# Altium schematic sheet Motor Driver.SchDoc (part 2 of 3)
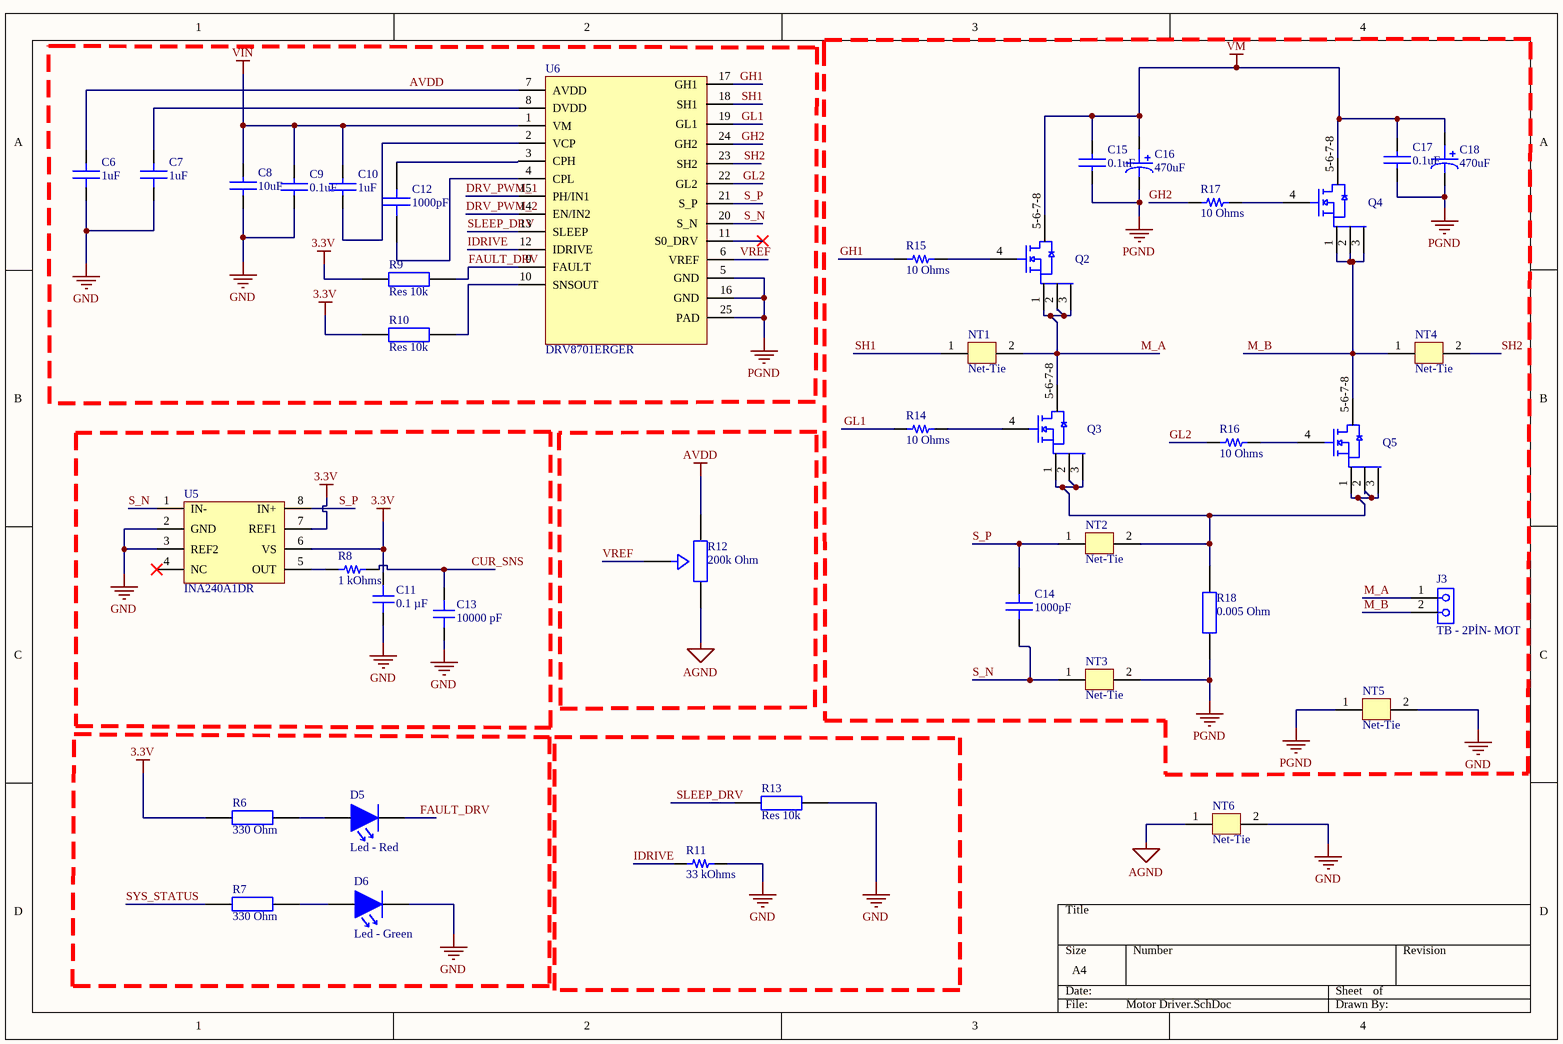
[diagram p1: Motor Driver.SchDoc]
## Library data of the parts
C6 C7 = GRM188R60J105KA01D: 0603 1 uF 6.3 V ±10% Tolerance X5R SMT Multilayer Ceramic Capacitor; Manufacturer: Murata; Manufacturer Lifecycle Status: NRND; Value: 1µF; Insulation Resistance: 500MΩ; Voltage: 6.3V; Supplier: Future Electronics; Supplier Part Number: 7369507; Manufacturer Part Number: GRM188R60J105KA01D; RoHS: Compliant; Category: Ceramic Capacitors; Stock: 12000; Pricing: 4000=0,0061, 16000=0,0059, 40000=0,0057, 100000=0,0056, 160000=0,0054 (USD); Case/Package: 0603; Case Code (Imperial): 0603; Case Code (Metric): 1608; Depth: 800µm; Dielectric: X5R; Dielectric Material: Ceramic; Height: 800µm; Lead Free: Lead Free; Length: 1.6mm; Lifecycle Status: NRND; Material: Ceramic; Max Operating Temperature: 85°C; Min Operating Temperature: -55°C; Mounting Technology: Surface Mount; Pins: 2; Number of Terminals: 2; Radiation Hardening: No; REACH SVHC: Yes; Schedule B: 8532240020, 8532240020|8532240020, 8532240020|8532240020|8532240020, 8532240020|8532240020|8532240020|8532240020; Termination: SMD/SMT; Thickness: 800µm; Tolerance: 10%; Voltage Rating: 6.3V; Voltage Rating (DC): 6.3V; Width: 800µm; ComponentLink1URL: https://datasheet.octopart.com:443/GRM188R60J105KA01D-Murata-datasheet-7599024.pdf?src-supplier=Newark; ComponentLink1Description: https://datasheet.octopart.com:443/GRM188R60J105KA01D-Murata-datasheet-7599024.pdf?src-supplier=Newark; ComponentLink2URL: https://datasheet.octopart.com:443/GRM188R60J105KA01D-Murata-datasheet-101584256.pdf?src-supplier=element14+APAC; ComponentLink2Description: https://datasheet.octopart.com:443/GRM188R60J105KA01D-Murata-datasheet-101584256.pdf?src-supplier=element14+APAC; ComponentLink3URL: https://datasheet.octopart.com:443/GRM188R60J105KA01D-Murata-datasheet-49135294.pdf?src-supplier=element14+APAC; ComponentLink3Description: https://datasheet.octopart.com:443/GRM188R60J105KA01D-Murata-datasheet-49135294.pdf?src-supplier=element14+APAC; ComponentLink4URL: https://datasheet.octopart.com:443/GRM188R60J105KA01D-Murata-datasheet-165579666.pdf?src-supplier=TME; ComponentLink4Description: https://datasheet.octopart.com:443/GRM188R60J105KA01D-Murata-datasheet-165579666.pdf?src-supplier=TME; ComponentLink5URL: https://datasheet.octopart.com:443/GRM188R60J105KA01D-Murata-datasheet-59876780.pdf?src-supplier=TME; ComponentLink5Description: https://datasheet.octopart.com:443/GRM188R60J105KA01D-Murata-datasheet-59876780.pdf?src-supplier=TME; ComponentLink6URL: https://datasheet.octopart.com:443/GRM188R60J105KA01D-Murata-datasheet-140704005.pdf?src-supplier=Ciiva; ComponentLink6Description: https://datasheet.octopart.com:443/GRM188R60J105KA01D-Murata-datasheet-140704005.pdf?src-supplier=Ciiva; ComponentLink7URL: https://datasheet.octopart.com:443/GRM188R60J105KA01D-Murata-datasheet-138742778.pdf?src-supplier=Ciiva; ComponentLink7Description: https://datasheet.octopart.com:443/GRM188R60J105KA01D-Murata-datasheet-138742778.pdf?src-supplier=Ciiva; ComponentLink8URL: https://datasheet.octopart.com:443/GRM188R60J105KA01D-Murata-datasheet-102370999.pdf?src-supplier=Future+Electronics; ComponentLink8Description: https://datasheet.octopart.com:443/GRM188R60J105KA01D-Murata-datasheet-102370999.pdf?src-supplier=Future+Electronics; ComponentLink9URL: https://datasheet.octopart.com:443/GRM188R60J105KA01D-Murata-datasheet-22122223.pdf?src-supplier=Future+Electronics; ComponentLink9Description: https://datasheet.octopart.com:443/GRM188R60J105KA01D-Murata-datasheet-22122223.pdf?src-supplier=Future+Electronics; ComponentLink10URL: https://datasheet.octopart.com:443/GRM188R60J105KA01D-Murata-datasheet-14400986.pdf?src-supplier=Future+Electronics; ComponentLink10Description: https://datasheet.octopart.com:443/GRM188R60J105KA01D-Murata-datasheet-14400986.pdf?src-supplier=Future+Electronics; ComponentLink11URL: https://datasheet.octopart.com:443/GRM188R60J105KA01D-Murata-datasheet-44107491.pdf?src-supplier=Future+Electronics; ComponentLink11Description: https://datasheet.octopart.com:443/GRM188R60J105KA01D-Murata-datasheet-44107491.pdf?src-supplier=Future+Electronics; ComponentLink12URL: https://datasheet.octopart.com/GRM188R60J105KA01D-Murata-datasheet-12515295.pdf; ComponentLink12Description: https://datasheet.octopart.com/GRM188R60J105KA01D-Murata-datasheet-12515295.pdf; ComponentLink13URL: https://datasheet.octopart.com/GRM188R60J105KA01D-Murata-datasheet-12510076.pdf; ComponentLink13Description: https://datasheet.octopart.com/GRM188R60J105KA01D-Murata-datasheet-12510076.pdf; ComponentLink14URL: https://datasheet.octopart.com/GRM188R60J105KA01D-Murata-datasheet-11978611.pdf; ComponentLink14Description: https://datasheet.octopart.com/GRM188R60J105KA01D-Murata-datasheet-11978611.pdf; ComponentLink15URL: https://datasheet.octopart.com/GRM188R60J105KA01D-Murata-datasheet-10025737.pdf; ComponentLink15Description: https://datasheet.octopart.com/GRM188R60J105KA01D-Murata-datasheet-10025737.pdf; ComponentLink16URL: https://datasheet.octopart.com/GRM188R60J105KA01D-Murata-datasheet-8819587.pdf; ComponentLink16Description: https://datasheet.octopart.com/GRM188R60J105KA01D-Murata-datasheet-8819587.pdf; ComponentLink17URL: https://datasheet.octopart.com/GRM188R60J105KA01D-Murata-datasheet-14401024.pdf; ComponentLink17Description: https://datasheet.octopart.com/GRM188R60J105KA01D-Murata-datasheet-14401024.pdf; ComponentLink18URL: https://datasheet.octopart.com:443/GRM188R60J105KA01D-Murata-datasheet-102.pdf?src-supplier=DigiKey; ComponentLink18Description: https://datasheet.octopart.com:443/GRM188R60J105KA01D-Murata-datasheet-102.pdf?src-supplier=DigiKey; ComponentLink19URL: https://datasheet.octopart.com:443/GRM188R60J105KA01D-Murata-datasheet-112596.pdf?src-supplier=Sierra+IC; ComponentLink19Description: https://datasheet.octopart.com:443/GRM188R60J105KA01D-Murata-datasheet-112596.pdf?src-supplier=Sierra+IC; ComponentLink20URL: https://datasheet.octopart.com:443/GRM188R60J105KA01D-Murata-datasheet-516848.pdf?src-supplier=Farnell; ComponentLink20Description: https://datasheet.octopart.com:443/GRM188R60J105KA01D-Murata-datasheet-516848.pdf?src-supplier=Farnell; ComponentLink21URL: http://sigma.octopart.com:80/reach_statement/Murata-company-16.pdf?src-supplier=Compliance+Statements; ComponentLink21Description: http://sigma.octopart.com:80/reach_statement/Murata-company-16.pdf?src-supplier=Compliance+Statements
C8 = GRM32ER71H106KA12L: 50V 10uF X7R ±10% 1210 Multilayer Ceramic Capacitors MLCC - SMD/SMT ROHS; Manufacturer: Murata; Value: 10µF; Supplier: Arrow Electronics; Supplier Part Number: GRM32ER71H106KA12L; Manufacturer Part Number: GRM32ER71H106KA12L; RoHS: Compliant; Category: Ceramic Capacitors; Stock: 87000; Pricing: 1000=0,294, 2000=0,286, 3000=0,279, 4000=0,276, 5000=0,269, 10000=0,266 (USD); Case/Package: 1210; Case Code (Imperial): 1210; Case Code (Metric): 3225; Depth: 2.5mm; Dielectric: X7R; Dielectric Material: Ceramic; Height: 2.5mm; Lead Free: Lead Free; Length: 3.2mm; Lifecycle Status: Production; Material: Ceramic; Max Operating Temperature: 125°C; Min Operating Temperature: -55°C; Mounting Technology: Surface Mount; Number of Terminals: 2; Packaging: Cut Tape; Radiation Hardening: No; REACH SVHC: Yes; Schedule B: 8532240020, 8532240020|8532240020|8532240020|8532240020|8532240020; Termination: SMD/SMT; Tolerance: 10%; Voltage: 50V; Voltage Rating: 50V; Voltage Rating (DC): 50V; Width: 2.5mm; ComponentLink1URL: https://datasheet.octopart.com:443/GRM32ER71H106KA12L-Murata-datasheet-182093906.pdf?src-supplier=IHS; ComponentLink1Description: https://datasheet.octopart.com:443/GRM32ER71H106KA12L-Murata-datasheet-182093906.pdf?src-supplier=IHS; ComponentLink2URL: https://datasheet.octopart.com:443/GRM32ER71H106KA12L-Murata-datasheet-22975648.pdf?src-supplier=Newark; ComponentLink2Description: https://datasheet.octopart.com:443/GRM32ER71H106KA12L-Murata-datasheet-22975648.pdf?src-supplier=Newark; ComponentLink3URL: https://datasheet.octopart.com:443/GRM32ER71H106KA12L-Murata-datasheet-62317418.pdf?src-supplier=element14+APAC; ComponentLink3Description: https://datasheet.octopart.com:443/GRM32ER71H106KA12L-Murata-datasheet-62317418.pdf?src-supplier=element14+APAC; ComponentLink4URL: https://datasheet.octopart.com/GRM32ER71H106KA12L-Murata-datasheet-12515295.pdf; ComponentLink4Description: https://datasheet.octopart.com/GRM32ER71H106KA12L-Murata-datasheet-12515295.pdf; ComponentLink5URL: https://datasheet.octopart.com/GRM32ER71H106KA12L-Murata-datasheet-12510076.pdf; ComponentLink5Description: https://datasheet.octopart.com/GRM32ER71H106KA12L-Murata-datasheet-12510076.pdf; ComponentLink6URL: https://datasheet.octopart.com/GRM32ER71H106KA12L-Murata-datasheet-11978611.pdf; ComponentLink6Description: https://datasheet.octopart.com/GRM32ER71H106KA12L-Murata-datasheet-11978611.pdf; ComponentLink7URL: https://datasheet.octopart.com/GRM32ER71H106KA12L-Murata-datasheet-10025737.pdf; ComponentLink7Description: https://datasheet.octopart.com/GRM32ER71H106KA12L-Murata-datasheet-10025737.pdf; ComponentLink8URL: https://datasheet.octopart.com/GRM32ER71H106KA12L-Murata-datasheet-8819587.pdf; ComponentLink8Description: https://datasheet.octopart.com/GRM32ER71H106KA12L-Murata-datasheet-8819587.pdf; ComponentLink9URL: https://datasheet.octopart.com/GRM32ER71H106KA12L-Murata-datasheet-12553172.pdf; ComponentLink9Description: https://datasheet.octopart.com/GRM32ER71H106KA12L-Murata-datasheet-12553172.pdf; ComponentLink10URL: https://datasheet.octopart.com:443/GRM32ER71H106KA12L-Murata-datasheet-83187960.pdf?src-supplier=TME; ComponentLink10Description: https://datasheet.octopart.com:443/GRM32ER71H106KA12L-Murata-datasheet-83187960.pdf?src-supplier=TME; ComponentLink11URL: https://datasheet.octopart.com:443/GRM32ER71H106KA12L-Murata-datasheet-22122223.pdf?src-supplier=Future+Electronics; ComponentLink11Description: https://datasheet.octopart.com:443/GRM32ER71H106KA12L-Murata-datasheet-22122223.pdf?src-supplier=Future+Electronics; ComponentLink12URL: https://datasheet.octopart.com:443/GRM32ER71H106KA12L-Murata-datasheet-44109769.pdf?src-supplier=Future+Electronics; ComponentLink12Description: https://datasheet.octopart.com:443/GRM32ER71H106KA12L-Murata-datasheet-44109769.pdf?src-supplier=Future+Electronics; ComponentLink13URL: http://sigma.octopart.com:80/reach_statement/Murata-company-16.pdf?src-supplier=Compliance+Statements; ComponentLink13Description: http://sigma.octopart.com:80/reach_statement/Murata-company-16.pdf?src-supplier=Compliance+Statements
C9 C15 C17 = GRM319R71H104KA01D: 1206 0.1 uF 50 V ±10 % Tolerance X7R Surface Mount Multilayer Ceramic Capacitor; Manufacturer: Murata; Manufacturer Lifecycle Status: TO BE DISCONTINUED; Value: 100nF; Tolerance: 10%; Voltage: 50V; Supplier: Farnell; Supplier Part Number: 4740640; Manufacturer Part Number: GRM319R71H104KA01D; RoHS: Compliant; Category: Ceramic Capacitors; Stock: 20000; Pricing: 10=0,0587, 250=0,0579, 1000=0,0571, 5000=0,0471, 10000=0,0436, 20000=0,0346 (EUR); Case/Package: 1206; Case Code (Imperial): 1206; Case Code (Metric): 3216; Depth: 1.6mm; Dielectric: X7R; Dielectric Material: Ceramic; Height: 850µm; Lead Free: Lead Free; Lead Pitch: 4mm; Length: 3.2mm; Lifecycle Status: EOL; Material: Ceramic; Max Operating Temperature: 125°C; Min Operating Temperature: -55°C; Mounting Technology: Surface Mount; Pins: 2; Number of Terminals: 2; Packaging: Tape and Reel; REACH SVHC: Yes; Schedule B: 8532240020; Termination: SMD/SMT; Thickness: 850µm; Voltage Rating: 50V; Voltage Rating (DC): 50V; Width: 1.6mm; ComponentLink1URL: https://datasheet.octopart.com/GRM319R71H104KA01D-Murata-datasheet-12515295.pdf; ComponentLink1Description: https://datasheet.octopart.com/GRM319R71H104KA01D-Murata-datasheet-12515295.pdf; ComponentLink2URL: https://datasheet.octopart.com/GRM319R71H104KA01D-Murata-datasheet-12510076.pdf; ComponentLink2Description: https://datasheet.octopart.com/GRM319R71H104KA01D-Murata-datasheet-12510076.pdf; ComponentLink3URL: https://datasheet.octopart.com/GRM319R71H104KA01D-Murata-datasheet-11978611.pdf; ComponentLink3Description: https://datasheet.octopart.com/GRM319R71H104KA01D-Murata-datasheet-11978611.pdf; ComponentLink4URL: https://datasheet.octopart.com/GRM319R71H104KA01D-Murata-datasheet-10025737.pdf; ComponentLink4Description: https://datasheet.octopart.com/GRM319R71H104KA01D-Murata-datasheet-10025737.pdf; ComponentLink5URL: https://datasheet.octopart.com/GRM319R71H104KA01D-Murata-datasheet-8819587.pdf; ComponentLink5Description: https://datasheet.octopart.com/GRM319R71H104KA01D-Murata-datasheet-8819587.pdf; ComponentLink6URL: https://datasheet.octopart.com/GRM319R71H104KA01D-Murata-datasheet-14402634.pdf; ComponentLink6Description: https://datasheet.octopart.com/GRM319R71H104KA01D-Murata-datasheet-14402634.pdf; ComponentLink7URL: https://datasheet.octopart.com:443/GRM319R71H104KA01D-Murata-datasheet-8817987.pdf?src-supplier=element14+APAC; ComponentLink7Description: https://datasheet.octopart.com:443/GRM319R71H104KA01D-Murata-datasheet-8817987.pdf?src-supplier=element14+APAC; ComponentLink8URL: https://datasheet.octopart.com:443/GRM319R71H104KA01D-Murata-datasheet-62317312.pdf?src-supplier=element14+APAC; ComponentLink8Description: https://datasheet.octopart.com:443/GRM319R71H104KA01D-Murata-datasheet-62317312.pdf?src-supplier=element14+APAC; ComponentLink9URL: https://datasheet.octopart.com:443/GRM319R71H104KA01D-Murata-datasheet-165579666.pdf?src-supplier=TME; ComponentLink9Description: https://datasheet.octopart.com:443/GRM319R71H104KA01D-Murata-datasheet-165579666.pdf?src-supplier=TME; ComponentLink10URL: https://datasheet.octopart.com:443/GRM319R71H104KA01D-Murata-datasheet-59876780.pdf?src-supplier=TME; ComponentLink10Description: https://datasheet.octopart.com:443/GRM319R71H104KA01D-Murata-datasheet-59876780.pdf?src-supplier=TME; ComponentLink11URL: https://datasheet.octopart.com:443/GRM319R71H104KA01D-Murata-datasheet-140708136.pdf?src-supplier=Ciiva; ComponentLink11Description: https://datasheet.octopart.com:443/GRM319R71H104KA01D-Murata-datasheet-140708136.pdf?src-supplier=Ciiva; ComponentLink12URL: https://datasheet.octopart.com:443/GRM319R71H104KA01D-Murata-datasheet-140706587.pdf?src-supplier=Ciiva; ComponentLink12Description: https://datasheet.octopart.com:443/GRM319R71H104KA01D-Murata-datasheet-140706587.pdf?src-supplier=Ciiva; ComponentLink13URL: https://datasheet.octopart.com:443/GRM319R71H104KA01D-Murata-datasheet-138745441.pdf?src-supplier=Ciiva; ComponentLink13Description: https://datasheet.octopart.com:443/GRM319R71H104KA01D-Murata-datasheet-138745441.pdf?src-supplier=Ciiva; ComponentLink14URL: https://datasheet.octopart.com:443/GRM319R71H104KA01D-Murata-datasheet-22122223.pdf?src-supplier=Future+Electronics; ComponentLink14Description: https://datasheet.octopart.com:443/GRM319R71H104KA01D-Murata-datasheet-22122223.pdf?src-supplier=Future+Electronics; ComponentLink15URL: https://datasheet.octopart.com:443/GRM319R71H104KA01D-Murata-datasheet-12510170.pdf?src-supplier=Future+Electronics; ComponentLink15Description: https://datasheet.octopart.com:443/GRM319R71H104KA01D-Murata-datasheet-12510170.pdf?src-supplier=Future+Electronics; ComponentLink16URL: https://datasheet.octopart.com:443/GRM319R71H104KA01D-Murata-datasheet-8517407.pdf?src-supplier=Future+Electronics; ComponentLink16Description: https://datasheet.octopart.com:443/GRM319R71H104KA01D-Murata-datasheet-8517407.pdf?src-supplier=Future+Electronics; ComponentLink17URL: https://datasheet.octopart.com:443/GRM319R71H104KA01D-Murata-datasheet-8387045.pdf?src-supplier=Future+Electronics; ComponentLink17Description: https://datasheet.octopart.com:443/GRM319R71H104KA01D-Murata-datasheet-8387045.pdf?src-supplier=Future+Electronics; ComponentLink18URL: https://datasheet.octopart.com:443/GRM319R71H104KA01D-Murata-datasheet-8324201.pdf?src-supplier=Future+Electronics; ComponentLink18Description: https://datasheet.octopart.com:443/GRM319R71H104KA01D-Murata-datasheet-8324201.pdf?src-supplier=Future+Electronics; ComponentLink19URL: https://datasheet.octopart.com:443/GRM319R71H104KA01D-Murata-datasheet-7628724.pdf?src-supplier=Future+Electronics; ComponentLink19Description: https://datasheet.octopart.com:443/GRM319R71H104KA01D-Murata-datasheet-7628724.pdf?src-supplier=Future+Electronics; ComponentLink20URL: https://datasheet.octopart.com:443/GRM319R71H104KA01D-Murata-datasheet-552801.pdf?src-supplier=Future+Electronics; ComponentLink20Description: https://datasheet.octopart.com:443/GRM319R71H104KA01D-Murata-datasheet-552801.pdf?src-supplier=Future+Electronics; ComponentLink21URL: https://datasheet.octopart.com:443/GRM319R71H104KA01D-Murata-datasheet-44782018.pdf?src-supplier=Future+Electronics; ComponentLink21Description: https://datasheet.octopart.com:443/GRM319R71H104KA01D-Murata-datasheet-44782018.pdf?src-supplier=Future+Electronics; ComponentLink22URL: https://datasheet.octopart.com:443/GRM319R71H104KA01D-Murata-datasheet-7618416.pdf?src-supplier=Jameco; ComponentLink22Description: https://datasheet.octopart.com:443/GRM319R71H104KA01D-Murata-datasheet-7618416.pdf?src-supplier=Jameco; ComponentLink23URL: https://datasheet.octopart.com:443/GRM319R71H104KA01D-Murata-datasheet-148214.pdf?src-supplier=Garrett; ComponentLink23Description: https://datasheet.octopart.com:443/GRM319R71H104KA01D-Murata-datasheet-148214.pdf?src-supplier=Garrett; ComponentLink24URL: https://datasheet.octopart.com:443/GRM319R71H104KA01D-Murata-datasheet-102.pdf?src-supplier=DigiKey; ComponentLink24Description: https://datasheet.octopart.com:443/GRM319R71H104KA01D-Murata-datasheet-102.pdf?src-supplier=DigiKey; ComponentLink25URL: https://datasheet.octopart.com:443/GRM319R71H104KA01D-Murata-datasheet-112596.pdf?src-supplier=Sierra+IC; ComponentLink25Description: https://datasheet.octopart.com:443/GRM319R71H104KA01D-Murata-datasheet-112596.pdf?src-supplier=Sierra+IC; ComponentLink26URL: http://sigma.octopart.com:80/reach_statement/Murata-company-16.pdf?src-supplier=Compliance+Statements; ComponentLink26Description: http://sigma.octopart.com:80/reach_statement/Murata-company-16.pdf?src-supplier=Compliance+Statements
C10 = GRM319R71C105KAA3D: 1206 1 uF 16 V ±10 % Tol. X7R Surface Mount Multilayer Ceramic Capacitor; Manufacturer: Murata; Manufacturer Lifecycle Status: NRND; Value: 1µF; Tolerance: 10%; Voltage: 16V; Supplier: Arrow Electronics; Supplier Part Number: GRM319R71C105KAA3D; Manufacturer Part Number: GRM319R71C105KAA3D; RoHS: Compliant; Category: Ceramic Capacitors; Stock: 2396; Pricing: 2247=0,0445 (USD); Case/Package: 1206; Case Code (Imperial): 1206; Case Code (Metric): 3216; China RoHS: Compliant; Depth: 1.6mm; Dielectric: X7R; Dielectric Material: Ceramic; Height: 850µm; Lead Free: Lead Free; Length: 3.2mm; Lifecycle Status: NRND; Material: Ceramic; Max Operating Temperature: 125°C; Min Operating Temperature: -55°C; Mounting Technology: Surface Mount; Number of Terminals: 2; Radiation Hardening: No; REACH SVHC: Yes; Schedule B: 8532240020, 8532240020|8532240020|8532240020|8532240020|8532240020; Termination: SMD/SMT; Thickness: 850µm; Voltage Rating: 16V; Voltage Rating (DC): 16V; Width: 1.6mm; ComponentLink1URL: https://datasheet.octopart.com:443/GRM319R71C105KAA3D-Murata-datasheet-11966710.pdf?src-supplier=_legacy+Avnet; ComponentLink1Description: https://datasheet.octopart.com:443/GRM319R71C105KAA3D-Murata-datasheet-11966710.pdf?src-supplier=_legacy+Avnet; ComponentLink2URL: https://datasheet.octopart.com:443/GRM319R71C105KAA3D-Murata-datasheet-165579666.pdf?src-supplier=TME; ComponentLink2Description: https://datasheet.octopart.com:443/GRM319R71C105KAA3D-Murata-datasheet-165579666.pdf?src-supplier=TME; ComponentLink3URL: https://datasheet.octopart.com:443/GRM319R71C105KAA3D-Murata-datasheet-59876780.pdf?src-supplier=TME; ComponentLink3Description: https://datasheet.octopart.com:443/GRM319R71C105KAA3D-Murata-datasheet-59876780.pdf?src-supplier=TME; ComponentLink4URL: https://datasheet.octopart.com:443/GRM319R71C105KAA3D-Murata-datasheet-140708078.pdf?src-supplier=Ciiva; ComponentLink4Description: https://datasheet.octopart.com:443/GRM319R71C105KAA3D-Murata-datasheet-140708078.pdf?src-supplier=Ciiva; ComponentLink5URL: https://datasheet.octopart.com:443/GRM319R71C105KAA3D-Murata-datasheet-140706587.pdf?src-supplier=Ciiva; ComponentLink5Description: https://datasheet.octopart.com:443/GRM319R71C105KAA3D-Murata-datasheet-140706587.pdf?src-supplier=Ciiva; ComponentLink6URL: https://datasheet.octopart.com:443/GRM319R71C105KAA3D-Murata-datasheet-138745384.pdf?src-supplier=Ciiva; ComponentLink6Description: https://datasheet.octopart.com:443/GRM319R71C105KAA3D-Murata-datasheet-138745384.pdf?src-supplier=Ciiva; ComponentLink7URL: https://datasheet.octopart.com:443/GRM319R71C105KAA3D-Murata-datasheet-22122223.pdf?src-supplier=Future+Electronics; ComponentLink7Description: https://datasheet.octopart.com:443/GRM319R71C105KAA3D-Murata-datasheet-22122223.pdf?src-supplier=Future+Electronics; ComponentLink8URL: https://datasheet.octopart.com:443/GRM319R71C105KAA3D-Murata-datasheet-14402607.pdf?src-supplier=Future+Electronics; ComponentLink8Description: https://datasheet.octopart.com:443/GRM319R71C105KAA3D-Murata-datasheet-14402607.pdf?src-supplier=Future+Electronics; ComponentLink9URL: https://datasheet.octopart.com:443/GRM319R71C105KAA3D-Murata-datasheet-44109134.pdf?src-supplier=Future+Electronics; ComponentLink9Description: https://datasheet.octopart.com:443/GRM319R71C105KAA3D-Murata-datasheet-44109134.pdf?src-supplier=Future+Electronics; ComponentLink10URL: https://datasheet.octopart.com/GRM319R71C105KAA3D-Murata-datasheet-12515295.pdf; ComponentLink10Description: https://datasheet.octopart.com/GRM319R71C105KAA3D-Murata-datasheet-12515295.pdf; ComponentLink11URL: https://datasheet.octopart.com/GRM319R71C105KAA3D-Murata-datasheet-12510076.pdf; ComponentLink11Description: https://datasheet.octopart.com/GRM319R71C105KAA3D-Murata-datasheet-12510076.pdf; ComponentLink12URL: https://datasheet.octopart.com/GRM319R71C105KAA3D-Murata-datasheet-11978611.pdf; ComponentLink12Description: https://datasheet.octopart.com/GRM319R71C105KAA3D-Murata-datasheet-11978611.pdf; ComponentLink13URL: https://datasheet.octopart.com/GRM319R71C105KAA3D-Murata-datasheet-10025737.pdf; ComponentLink13Description: https://datasheet.octopart.com/GRM319R71C105KAA3D-Murata-datasheet-10025737.pdf; ComponentLink14URL: https://datasheet.octopart.com/GRM319R71C105KAA3D-Murata-datasheet-8819587.pdf; ComponentLink14Description: https://datasheet.octopart.com/GRM319R71C105KAA3D-Murata-datasheet-8819587.pdf; ComponentLink15URL: https://datasheet.octopart.com/GRM319R71C105KAA3D-Murata-datasheet-12526482.pdf; ComponentLink15Description: https://datasheet.octopart.com/GRM319R71C105KAA3D-Murata-datasheet-12526482.pdf; ComponentLink16URL: http://sigma.octopart.com:80/reach_statement/Murata-company-16.pdf?src-supplier=Compliance+Statements; ComponentLink16Description: http://sigma.octopart.com:80/reach_statement/Murata-company-16.pdf?src-supplier=Compliance+Statements
C11 = AC0603KPX7R7BB104: CAP CER 0.1UF 16V X7R 0603; manufacturer: Yageo; Tolerance: ±10%; Part Number: AC0603KPX7R7BB104; Capacitance: 0.1 µF; Applications: Automotive; componentlink1description: Datasheet; componentlink1url: https://www.yageo.com/upload/media/product/productsearch/datasheet/mlcc/UPY-AC_NP0X7RX7S_6.3V-to-2KV_19.pdf; componentlink2description: DigiKey Link; componentlink2url: https://www.digikey.com/en/products/detail/yageo/AC0603KPX7R7BB104/16797573; Device Package: 0603 (1608 Metric); lastupdated: 9.02.2024 20:08:40; Lifecycle Status: Active; Minimum Order: 1; Mounting Type: Surface Mount, MLCC; Operating Temperature: -55°C ~ 125°C; Package / Case: 0603 (1608 Metric); packaging: TapeAndReel; partid: 56471; price: 0.02; Ratings: AEC-Q200; series: AC; Size / Dimension: 0.063" L x 0.031" W (1.60mm x 0.80mm); Supplier 1: DigiKey; Supplier Part Number 1: 13-AC0603KPX7R7BB104CT-ND; Temperature Coefficient: X7R; Thickness (Max): 0.035" (0.90mm); value: 0.1 µF; Voltage - Rated: 16V
C12 C14 = GRM155R71C102KA01D: 0402 1 nF 16 V ±10% Tolerance X7R SMT Multilayer Ceramic Capacitor; Manufacturer: Murata; Manufacturer Lifecycle Status: NRND; Value: 1nF; Voltage: 16V; Supplier: Farnell; Supplier Part Number: 4326782; Manufacturer Part Number: GRM155R71C102KA01D; RoHS: Compliant; Category: Ceramic Capacitors; Stock: 42276; Pricing: 10=0,0163, 100=0,0134, 500=0,0086, 2500=0,0057, 5000=0,0056 (EUR); Case/Package: 0402; Case Code (Imperial): 0402; Case Code (Metric): 1005; Depth: 500µm; Dielectric: X7R; Dielectric Material: Ceramic; Height: 500µm; Lead Free: Lead Free; Length: 1mm; Lifecycle Status: NRND; Material: Ceramic; Max Operating Temperature: 125°C; Min Operating Temperature: -55°C; Mounting Technology: Surface Mount; Pins: 2; Number of Terminals: 2; Packaging: Cut Tape; Radiation Hardening: No; REACH SVHC: Yes; Schedule B: 8532240020, 8532240020|8532240020|8532240020|8532240020|8532240020; Termination: SMD/SMT; Thickness: 500µm; Tolerance: 10%; Voltage Rating: 16V; Voltage Rating (DC): 16V; Width: 500µm; ComponentLink1URL: https://datasheet.octopart.com:443/GRM155R71C102KA01D-Murata-datasheet-66077076.pdf?src-supplier=element14+APAC; ComponentLink1Description: https://datasheet.octopart.com:443/GRM155R71C102KA01D-Murata-datasheet-66077076.pdf?src-supplier=element14+APAC; ComponentLink2URL: https://datasheet.octopart.com:443/GRM155R71C102KA01D-Murata-datasheet-14400556.pdf?src-supplier=Future+Electronics; ComponentLink2Description: https://datasheet.octopart.com:443/GRM155R71C102KA01D-Murata-datasheet-14400556.pdf?src-supplier=Future+Electronics; ComponentLink3URL: https://datasheet.octopart.com:443/GRM155R71C102KA01D-Murata-datasheet-22122223.pdf?src-supplier=Future+Electronics; ComponentLink3Description: https://datasheet.octopart.com:443/GRM155R71C102KA01D-Murata-datasheet-22122223.pdf?src-supplier=Future+Electronics; ComponentLink4URL: https://datasheet.octopart.com:443/GRM155R71C102KA01D-Murata-datasheet-44106280.pdf?src-supplier=Future+Electronics; ComponentLink4Description: https://datasheet.octopart.com:443/GRM155R71C102KA01D-Murata-datasheet-44106280.pdf?src-supplier=Future+Electronics; ComponentLink5URL: https://datasheet.octopart.com:443/GRM155R71C102KA01D-Murata-datasheet-165579666.pdf?src-supplier=TME; ComponentLink5Description: https://datasheet.octopart.com:443/GRM155R71C102KA01D-Murata-datasheet-165579666.pdf?src-supplier=TME; ComponentLink6URL: https://datasheet.octopart.com:443/GRM155R71C102KA01D-Murata-datasheet-141266224.pdf?src-supplier=Ciiva; ComponentLink6Description: https://datasheet.octopart.com:443/GRM155R71C102KA01D-Murata-datasheet-141266224.pdf?src-supplier=Ciiva; ComponentLink7URL: https://datasheet.octopart.com:443/GRM155R71C102KA01D-Murata-datasheet-140690967.pdf?src-supplier=Ciiva; ComponentLink7Description: https://datasheet.octopart.com:443/GRM155R71C102KA01D-Murata-datasheet-140690967.pdf?src-supplier=Ciiva; ComponentLink8URL: https://datasheet.octopart.com:443/GRM155R71C102KA01D-Murata-datasheet-138740885.pdf?src-supplier=Ciiva; ComponentLink8Description: https://datasheet.octopart.com:443/GRM155R71C102KA01D-Murata-datasheet-138740885.pdf?src-supplier=Ciiva; ComponentLink9URL: https://datasheet.octopart.com/GRM155R71C102KA01D-Murata-datasheet-12515295.pdf; ComponentLink9Description: https://datasheet.octopart.com/GRM155R71C102KA01D-Murata-datasheet-12515295.pdf; ComponentLink10URL: https://datasheet.octopart.com/GRM155R71C102KA01D-Murata-datasheet-12510076.pdf; ComponentLink10Description: https://datasheet.octopart.com/GRM155R71C102KA01D-Murata-datasheet-12510076.pdf; ComponentLink11URL: https://datasheet.octopart.com/GRM155R71C102KA01D-Murata-datasheet-11978611.pdf; ComponentLink11Description: https://datasheet.octopart.com/GRM155R71C102KA01D-Murata-datasheet-11978611.pdf; ComponentLink12URL: https://datasheet.octopart.com/GRM155R71C102KA01D-Murata-datasheet-10025737.pdf; ComponentLink12Description: https://datasheet.octopart.com/GRM155R71C102KA01D-Murata-datasheet-10025737.pdf; ComponentLink13URL: https://datasheet.octopart.com/GRM155R71C102KA01D-Murata-datasheet-8819587.pdf; ComponentLink13Description: https://datasheet.octopart.com/GRM155R71C102KA01D-Murata-datasheet-8819587.pdf; ComponentLink14URL: http://sigma.octopart.com:80/reach_statement/Murata-company-16.pdf?src-supplier=Compliance+Statements; ComponentLink14Description: http://sigma.octopart.com:80/reach_statement/Murata-company-16.pdf?src-supplier=Compliance+Statements
C13 = C0402C103K1RACTU: CAP CER 0402 10NF 100VDC X7R; manufacturer: KEMET; Tolerance: ±10%; Voltage - Rated: 100V; Part Number: C0402C103K1RACTU; Capacitance: 10000 pF; Applications: Bypass, Decoupling; componentlink1description: Datasheet; componentlink1url: https://connect.kemet.com:7667/gateway/IntelliData-ComponentDocumentation/1.0/download/datasheet/C0402C103K1RACTU; componentlink2description: DigiKey Link; componentlink2url: https://www.digikey.com/en/products/detail/kemet/C0402C103K1RACTU/19200729; Device Package: 0402 (1005 Metric); lastupdated: 9.02.2024 20:03:26; Lifecycle Status: Active; Minimum Order: 1; Mounting Type: Surface Mount, MLCC; Operating Temperature: -55°C ~ 125°C; Package / Case: 0402 (1005 Metric); packaging: TapeAndReel; partid: 55599; price: 0.02; series: SMD Comm X7R; Size / Dimension: 0.039" L x 0.020" W (1.00mm x 0.50mm); Supplier 1: DigiKey; Supplier Part Number 1: 399-C0402C103K1RACTUCT-ND; Temperature Coefficient: X7R; Thickness (Max): 0.022" (0.55mm); value: 10000 pF
C16 C18 = EEU-FR1V471LB: Aluminum Electrolytic Capacitor, Polarized, Aluminum (wet), 25V, 20% +Tol, 20% -Tol, 560uF; Manufacturer: Panasonic; Manufacturer Lifecycle Status: ACTIVE; Part Series: FR-A; Value: 470µF; ESR (Equivalent Series Resistance): 30mΩ; Lead Diameter: 600µm; Leakage Current: 164.5µA; Life (Hours): 9000hours; Polarity: Polar; Ripple Current: 1.56A; Voltage Rating: 35V; Supplier: Future Electronics; Supplier Part Number: 3028793; Manufacturer Part Number: EEU-FR1V471LB; RoHS: Compliant; Category: Aluminum Electrolytic Capacitors; Stock: 24000; Pricing: 1000=0,131, 2000=0,13, 4000=0,128, 5000=0,127, 15000=0,124 (USD); Case/Package: Radial; Contact Plating: Tin; Diameter: 8mm; Features: General Purpose; Height: 22mm; Height - Seated (Max): 21.9964mm; Impedance: 30mΩ; Lead Free: Lead Free; Lead Pitch: 5mm; Length: 20mm; Lifecycle Status: Production; Max Operating Temperature: 105°C; Min Operating Temperature: -40°C; Mounting Technology: PCB, Through Hole; Number of Terminals: 2; Radiation Hardening: No; REACH SVHC: Yes; Schedule B: 8532220020, 8532220020|8532220020|8532220020|8532220020|8532220020; Terminal Pitch: 5mm; Termination: Radial; Tolerance: 20%; Voltage Rating (DC): 35V; ComponentLink1URL: https://datasheet.octopart.com:443/EEU-FR1V471LB-Panasonic-datasheet-62330550.pdf?src-supplier=Panasonic; ComponentLink1Description: https://datasheet.octopart.com:443/EEU-FR1V471LB-Panasonic-datasheet-62330550.pdf?src-supplier=Panasonic; ComponentLink2URL: https://datasheet.octopart.com:443/EEU-FR1V471LB-Panasonic-datasheet-154766147.pdf?src-supplier=JRH+Electronics; ComponentLink2Description: https://datasheet.octopart.com:443/EEU-FR1V471LB-Panasonic-datasheet-154766147.pdf?src-supplier=JRH+Electronics; ComponentLink3URL: https://datasheet.octopart.com:443/EEU-FR1V471LB-Panasonic-datasheet-38939130.pdf?src-supplier=RS+(Formerly+Allied+Electronics); ComponentLink3Description: https://datasheet.octopart.com:443/EEU-FR1V471LB-Panasonic-datasheet-38939130.pdf?src-supplier=RS+(Formerly+Allied+Electronics); ComponentLink4URL: https://datasheet.octopart.com:443/EEU-FR1V471LB-Panasonic-datasheet-27908667.pdf?src-supplier=RS+(Formerly+Allied+Electronics); ComponentLink4Description: https://datasheet.octopart.com:443/EEU-FR1V471LB-Panasonic-datasheet-27908667.pdf?src-supplier=RS+(Formerly+Allied+Electronics); ComponentLink5URL: https://datasheet.octopart.com:443/EEU-FR1V471LB-Panasonic-datasheet-56871308.pdf?src-supplier=RS+(Formerly+Allied+Electronics); ComponentLink5Description: https://datasheet.octopart.com:443/EEU-FR1V471LB-Panasonic-datasheet-56871308.pdf?src-supplier=RS+(Formerly+Allied+Electronics); ComponentLink6URL: https://datasheet.octopart.com:443/EEU-FR1V471LB-Panasonic-datasheet-13267316.pdf?src-supplier=Newark; ComponentLink6Description: https://datasheet.octopart.com:443/EEU-FR1V471LB-Panasonic-datasheet-13267316.pdf?src-supplier=Newark; ComponentLink7URL: https://datasheet.octopart.com:443/EEU-FR1V471LB-Panasonic-datasheet-16820802.pdf?src-supplier=Newark; ComponentLink7Description: https://datasheet.octopart.com:443/EEU-FR1V471LB-Panasonic-datasheet-16820802.pdf?src-supplier=Newark; ComponentLink8URL: https://datasheet.octopart.com:443/EEUFR1V471LB-Panasonic-datasheet-150469843.pdf?src-supplier=TME; ComponentLink8Description: https://datasheet.octopart.com:443/EEUFR1V471LB-Panasonic-datasheet-150469843.pdf?src-supplier=TME; ComponentLink9URL: https://datasheet.octopart.com:443/EEU-FR1V471LB-Panasonic-datasheet-32589663.pdf?src-supplier=Electro+Sonic; ComponentLink9Description: https://datasheet.octopart.com:443/EEU-FR1V471LB-Panasonic-datasheet-32589663.pdf?src-supplier=Electro+Sonic
D5 = LTST-C170KRKT: Single-color LEDs; LITEON; LTST-C170KRKT; Red; 130 °; 2 V; 0805; Manufacturer: Lite-On; Dominant Wavelength: 631nm; Forward Current: 30mA; Forward Voltage: 2.4V; Lens Color: Clear, Colorless; Lens Style: Clear; Luminous Intensity: 18mcd; Number of Circuits: 1; Peak Wavelength: 639nm; Power Dissipation: 75mW; Reverse Voltage: 5V; Shape: Rectangular; Test Current: 20mA; Viewing Angle: 130°; Designed: Emre; Supplier: Avnet; Supplier Part Number: LTST-C170KRKT; Manufacturer Part Number: LTST-C170KRKT; RoHS: Compliant; Category: LEDs; Stock: 195000; Pricing: 6000=0,03219, 12000=0,03146, 24000=0,03073, 48000=0,03001, 96000=0,02928 (USD); Case/Package: 0805; Case Code (Imperial): 0805; Case Code (Metric): 2012; China RoHS: Compliant; Color: Red; Depth: 1.6mm; Height: 1.1mm; Illumination Color: Red; Lead Free: Lead Free; Length: 3.2mm; Lens Transparency: Clear; Lifecycle Status: Production; Max Operating Temperature: 85°C; Min Operating Temperature: -55°C; Mounting Technology: Surface Mount; Number of Elements: 1; Number of LEDs: 1; Pins: 2; Number of Terminals: 2; Packaging: Cut Tape; Power Rating: 75mW; Radiation Hardening: No; REACH SVHC: Yes; Schedule B: 8541402000, 8541402000|8541402000|8541402000|8541402000|8541402000; Terminal Pitch: 2.1mm; Wavelength: 631nm; Width: 1.25mm; ComponentLink1URL: https://datasheet.octopart.com:443/LTST-C170KRKT-Lite-On-datasheet-26684674.pdf?src-supplier=Upverter; ComponentLink1Description: https://datasheet.octopart.com:443/LTST-C170KRKT-Lite-On-datasheet-26684674.pdf?src-supplier=Upverter; ComponentLink2URL: https://datasheet.octopart.com:443/LTST-C170KRKT-Lite-On-datasheet-180605146.pdf?src-supplier=IHS; ComponentLink2Description: https://datasheet.octopart.com:443/LTST-C170KRKT-Lite-On-datasheet-180605146.pdf?src-supplier=IHS; ComponentLink3URL: https://datasheet.octopart.com:443/LTST-C170KRKT-Lite-On-datasheet-158436.pdf?src-supplier=_legacy+Avnet; ComponentLink3Description: https://datasheet.octopart.com:443/LTST-C170KRKT-Lite-On-datasheet-158436.pdf?src-supplier=_legacy+Avnet; ComponentLink4URL: https://datasheet.octopart.com:443/LTST-C170KRKT-Lite-On-datasheet-157246157.pdf?src-supplier=ODG+(Origin+Data+Global); ComponentLink4Description: https://datasheet.octopart.com:443/LTST-C170KRKT-Lite-On-datasheet-157246157.pdf?src-supplier=ODG+(Origin+Data+Global); ComponentLink5URL: https://datasheet.octopart.com:443/LTST-C170KRKT-Lite-On-datasheet-166322636.pdf?src-supplier=TME; ComponentLink5Description: https://datasheet.octopart.com:443/LTST-C170KRKT-Lite-On-datasheet-166322636.pdf?src-supplier=TME; ComponentLink6URL: https://datasheet.octopart.com:443/LTST-C170KRKT-Lite-On-datasheet-165573808.pdf?src-supplier=TME; ComponentLink6Description: https://datasheet.octopart.com:443/LTST-C170KRKT-Lite-On-datasheet-165573808.pdf?src-supplier=TME; ComponentLink7URL: https://datasheet.octopart.com:443/LTST-C170KRKT-Lite-On-datasheet-8325281.pdf?src-supplier=Future+Electronics; ComponentLink7Description: https://datasheet.octopart.com:443/LTST-C170KRKT-Lite-On-datasheet-8325281.pdf?src-supplier=Future+Electronics; ComponentLink8URL: https://datasheet.octopart.com:443/LTST-C170KRKT-Lite-On-datasheet-94966.pdf?src-supplier=DigiKey; ComponentLink8Description: https://datasheet.octopart.com:443/LTST-C170KRKT-Lite-On-datasheet-94966.pdf?src-supplier=DigiKey
D6 = LTST-C171GKT: LED Low-Power Uni-Color Green 565nm 2.1V 2-Pin Chip LED T/R; Manufacturer: Lite-On; Dominant Wavelength: 569nm; Forward Current: 30mA; Forward Voltage: 2.6V; Lens Color: Clear, Colorless; Lens Style: Clear; Luminous Intensity: 12mcd; Number of Circuits: 1; Power Dissipation: 100mW; Reverse Voltage: 5V; Shape: Rectangular; Test Current: 10mA; Viewing Angle: 130°; Designed: Emre; Supplier: Future Electronics; Supplier Part Number: 5010270; Manufacturer Part Number: LTST-C171GKT; RoHS: Compliant; Category: LEDs; Stock: 63000; Pricing: 3000=0,0234, 9000=0,0228, 30000=0,0223, 60000=0,0219, 120000=0,0213 (USD); Case/Package: 0805; Case Code (Imperial): 0805; Case Code (Metric): 2012; China RoHS: Compliant; Color: Green; Contact Plating: Gold; Depth: 1.25mm; Height: 800µm; Illumination Color: Green; Lead Free: Lead Free; Length: 2mm; Lens Transparency: Clear; Lifecycle Status: Production; Max Operating Temperature: 85°C; Min Operating Temperature: -55°C; Mounting Technology: Surface Mount; Number of Elements: 1; Number of LEDs: 1; Pins: 2; Number of Terminals: 2; Peak Wavelength: 565nm; Power Rating: 100mW; Radiation Hardening: No; REACH SVHC: Yes; Schedule B: 8541402000, 8541402000|8541402000, 8541402000|8541402000|8541402000, 8541402000|8541402000|8541402000|8541402000; Terminal Pitch: 2.5mm; Wavelength: 569nm; Width: 1.25mm; ComponentLink1URL: https://datasheet.octopart.com:443/LTST-C171GKT-Lite-On-datasheet-95087.pdf?src-supplier=Upverter; ComponentLink1Description: https://datasheet.octopart.com:443/LTST-C171GKT-Lite-On-datasheet-95087.pdf?src-supplier=Upverter; ComponentLink2URL: https://sigma.octopart.com:443/141439007/technical_drawing/Lite-On-LTST-C171GKT.pdf?src-supplier=Upverter; ComponentLink2Description: https://sigma.octopart.com:443/141439007/technical_drawing/Lite-On-LTST-C171GKT.pdf?src-supplier=Upverter; ComponentLink3URL: https://datasheet.octopart.com:443/LTST-C171GKT-Lite-On-datasheet-180605156.pdf?src-supplier=IHS; ComponentLink3Description: https://datasheet.octopart.com:443/LTST-C171GKT-Lite-On-datasheet-180605156.pdf?src-supplier=IHS; ComponentLink4URL: https://datasheet.octopart.com:443/LTST-C171GKT-Lite-On-datasheet-158474.pdf?src-supplier=Arrow+Electronics; ComponentLink4Description: https://datasheet.octopart.com:443/LTST-C171GKT-Lite-On-datasheet-158474.pdf?src-supplier=Arrow+Electronics; ComponentLink5URL: https://datasheet.octopart.com:443/LTST-C171GKT-Lite-On-datasheet-7823512.pdf?src-supplier=Jameco; ComponentLink5Description: https://datasheet.octopart.com:443/LTST-C171GKT-Lite-On-datasheet-7823512.pdf?src-supplier=Jameco; ComponentLink6URL: https://datasheet.octopart.com:443/LTST-C171GKT-Lite-On-datasheet-62340966.pdf?src-supplier=TME; ComponentLink6Description: https://datasheet.octopart.com:443/LTST-C171GKT-Lite-On-datasheet-62340966.pdf?src-supplier=TME
Q2-Q5 = BSC010N04LSI: Transistor: N-MOSFET; unipolar; 40V; 100A; 139W; PG-TDSON-8; Manufacturer: Infineon; Manufacturer Part Number: BSC010N04LSIATMA1; Continuous Drain Current (ID): 37A; Drain to Source Resistance: 1.4mΩ; Fall Time: 17ns; Gate to Source Voltage (Vgs): 20V; Input Capacitance: 6.2nF; Max Junction Temperature (Tj): 150°C; Number of Channels: 1; On-State Resistance: 1.05mΩ; Power Dissipation: 2.5W; Rise Time: 48ns; Turn-Off Delay Time: 33ns; Turn-On Delay Time: 9ns; Supplier: Farnell; Supplier Part Number: BSC010N04LSIATMA1; RoHS: Compliant; Category: MOSFETs; Stock: 10731; Pricing: 5=3,14, 50=2,04, 250=1,46, 1000=1,02, 3000=1 (EUR); China RoHS: Non-Compliant; Country of Origin: Germany, Mainland China; Drain to Source Breakdown Voltage: 40V; Drain to Source Voltage (Vdss): 40V; Export Control Classification Number (ECCN) Code: EAR99; Halogen Free: Halogen Free; Height: 1.1mm; Introduction Date: 2012-02-06; Lead Free: Contains Lead; Lifecycle Status: Production; Max Dual Supply Voltage: 40V; Max Operating Temperature: 150°C; Max Power Dissipation: 139W; Min Breakdown Voltage: 40V; Min Operating Temperature: -55°C; Mounting Technology: Surface Mount; Number of Elements: 1; Pins: 8; Number of Terminals: 8; Package Quantity: 5000; Packaging: Tape & Reel; Rds On Max: 1.05mΩ; REACH SVHC: No; Schedule B: 8541290080, 8541290080|8541290080|8541290080|8541290080|8541290080|8541290080|8541290080|8541290080|8541290080|8541290080|8541290080|8541290080|8541290080|8541290080|8541290080|8541290080|8541290080|8541290080|8541290080|8541290080|8541290080|8541290080|8541290080|85; ComponentLink1URL: https://datasheet.octopart.com:443/BSC010N04LSIATMA1-Infineon-datasheet-82520598.pdf?src-supplier=ODG+(Origin+Data+Global); ComponentLink1Description: https://datasheet.octopart.com:443/BSC010N04LSIATMA1-Infineon-datasheet-82520598.pdf?src-supplier=ODG+(Origin+Data+Global); ComponentLink2URL: https://datasheet.octopart.com:443/BSC010N04LSIATMA1-Infineon-datasheet-62293607.pdf?src-supplier=TME; ComponentLink2Description: https://datasheet.octopart.com:443/BSC010N04LSIATMA1-Infineon-datasheet-62293607.pdf?src-supplier=TME; ComponentLink3URL: http://sigma.octopart.com:80/conflict_mineral_statement/Infineon-company-51.pdf?src-supplier=Compliance+Statements; ComponentLink3Description: http://sigma.octopart.com:80/conflict_mineral_statement/Infineon-company-51.pdf?src-supplier=Compliance+Statements
R6 R7 = RC0603FR-07330RL: Res Thick Film 0603 330 Ohm 1% 0.1W(1/10W) ±100ppm/C Pad SMD T/R; Manufacturer: Yageo Group; Value: 47µF; ESR (Equivalent Series Resistance): 800mΩ; Max Power Dissipation: 100mW; Temperature Coefficient: 100ppm/°C; Voltage Rating: 16V; Voltage Rating (AC): 50V; Working Voltage: 75V; Supplier: Farnell; Supplier Part Number: 9238425; Manufacturer Part Number: RC0603FR-07330RL; RoHS: Compliant; Category: Chip SMD Resistors; Stock: 528709; Pricing: 10=0,0086, 100=0,0077, 500=0,0061, 1000=0,0046, 2500=0,0036 (EUR); Case/Package: 2917; Case Code (Imperial): 2917; Case Code (Metric): 7343; China RoHS: Non-Compliant; Composition: Thick Film; Depth: 800µm; Features: Moisture Resistant; Height: 450µm; Lead Free: Lead Free; Length: 7.3mm; Lifecycle Status: Production; Max Operating Temperature: 155°C; Min Operating Temperature: -55°C; Mounting Technology: Surface Mount; Pins: 2; Number of Terminals: 2; Number of Terminations: 2; Packaging: Tape and Reel; Power Dissipation: 100mW; Power Rating: 100mW; Radiation Hardening: No; REACH SVHC: Yes; Schedule B: 8533210045, 8533210045|8533210045, 8533210045|8533210045|8533210045, 8533210045|8533210045|8533210045|8533210045; Termination: SMD/SMT; Tolerance: 1%; Voltage Rating (DC): 16V; Width: 800µm; ComponentLink1URL: https://datasheet.octopart.com:443/RC0603FR-07330RL-Yageo-datasheet-175887523.pdf?src-supplier=IHS; ComponentLink1Description: https://datasheet.octopart.com:443/RC0603FR-07330RL-Yageo-datasheet-175887523.pdf?src-supplier=IHS; ComponentLink2URL: https://datasheet.octopart.com:443/RC0603FR-07330RL-Yageo-datasheet-62067350.pdf?src-supplier=Newark; ComponentLink2Description: https://datasheet.octopart.com:443/RC0603FR-07330RL-Yageo-datasheet-62067350.pdf?src-supplier=Newark; ComponentLink3URL: https://datasheet.octopart.com:443/RC0603FR-07330RL-Yageo-datasheet-12596169.pdf?src-supplier=Newark; ComponentLink3Description: https://datasheet.octopart.com:443/RC0603FR-07330RL-Yageo-datasheet-12596169.pdf?src-supplier=Newark; ComponentLink4URL: https://datasheet.octopart.com:443/RC0603FR-07330RL-Yageo-datasheet-503470.pdf?src-supplier=Newark; ComponentLink4Description: https://datasheet.octopart.com:443/RC0603FR-07330RL-Yageo-datasheet-503470.pdf?src-supplier=Newark; ComponentLink5URL: https://datasheet.octopart.com:443/RC0603FR-07330RL-Yageo-datasheet-34211833.pdf?src-supplier=Newark; ComponentLink5Description: https://datasheet.octopart.com:443/RC0603FR-07330RL-Yageo-datasheet-34211833.pdf?src-supplier=Newark; ComponentLink6URL: https://datasheet.octopart.com:443/RC0603FR-07330RL-Yageo-datasheet-103092701.pdf?src-supplier=Upverter; ComponentLink6Description: https://datasheet.octopart.com:443/RC0603FR-07330RL-Yageo-datasheet-103092701.pdf?src-supplier=Upverter; ComponentLink7URL: https://datasheet.octopart.com:443/RC0603FR-07330RL-Yageo-datasheet-98239111.pdf?src-supplier=Upverter; ComponentLink7Description: https://datasheet.octopart.com:443/RC0603FR-07330RL-Yageo-datasheet-98239111.pdf?src-supplier=Upverter; ComponentLink8URL: https://datasheet.octopart.com:443/RC0603FR-07330RL-Yageo-datasheet-8328172.pdf?src-supplier=element14+APAC; ComponentLink8Description: https://datasheet.octopart.com:443/RC0603FR-07330RL-Yageo-datasheet-8328172.pdf?src-supplier=element14+APAC; ComponentLink9URL: https://datasheet.octopart.com:443/RC0603FR-07330RL-Yageo-datasheet-15599030.pdf?src-supplier=Future+Electronics; ComponentLink9Description: https://datasheet.octopart.com:443/RC0603FR-07330RL-Yageo-datasheet-15599030.pdf?src-supplier=Future+Electronics; ComponentLink10URL: https://datasheet.octopart.com:443/RC0603FR-07330RL-Yageo-datasheet-164759695.pdf?src-supplier=Future+Electronics; ComponentLink10Description: https://datasheet.octopart.com:443/RC0603FR-07330RL-Yageo-datasheet-164759695.pdf?src-supplier=Future+Electronics; ComponentLink11URL: https://datasheet.octopart.com:443/RC0603FR-07330RL-Yageo-datasheet-137700087.pdf?src-supplier=Future+Electronics; ComponentLink11Description: https://datasheet.octopart.com:443/RC0603FR-07330RL-Yageo-datasheet-137700087.pdf?src-supplier=Future+Electronics; ComponentLink12URL: https://datasheet.octopart.com:443/RC0603FR-07330RL-Yageo-datasheet-27584510.pdf?src-supplier=Future+Electronics; ComponentLink12Description: https://datasheet.octopart.com:443/RC0603FR-07330RL-Yageo-datasheet-27584510.pdf?src-supplier=Future+Electronics; ComponentLink13URL: https://datasheet.octopart.com:443/RC0603FR-07330RL-Yageo-datasheet-8324193.pdf?src-supplier=Future+Electronics; ComponentLink13Description: https://datasheet.octopart.com:443/RC0603FR-07330RL-Yageo-datasheet-8324193.pdf?src-supplier=Future+Electronics; ComponentLink14URL: https://datasheet.octopart.com:443/RC0603FR-07330RL-Yageo-datasheet-79472498.pdf?src-supplier=Megastar; ComponentLink14Description: https://datasheet.octopart.com:443/RC0603FR-07330RL-Yageo-datasheet-79472498.pdf?src-supplier=Megastar; ComponentLink15URL: https://datasheet.octopart.com/RC0603FR-07330RL-Yageo-datasheet-73766026.pdf; ComponentLink15Description: https://datasheet.octopart.com/RC0603FR-07330RL-Yageo-datasheet-73766026.pdf; ComponentLink16URL: https://datasheet.octopart.com:443/RC0603FR-07330RL-Yageo-datasheet-13691069.pdf?src-supplier=Farnell; ComponentLink16Description: https://datasheet.octopart.com:443/RC0603FR-07330RL-Yageo-datasheet-13691069.pdf?src-supplier=Farnell; ComponentLink17URL: https://datasheet.octopart.com:443/RC0603FR-07330RL-Yageo-datasheet-118562.pdf?src-supplier=DigiKey; ComponentLink17Description: https://datasheet.octopart.com:443/RC0603FR-07330RL-Yageo-datasheet-118562.pdf?src-supplier=DigiKey; ComponentLink18URL: http://sigma.octopart.com:80/conflict_mineral_statement/Yageo-company-3.pdf?src-supplier=Compliance+Statements; ComponentLink18Description: http://sigma.octopart.com:80/conflict_mineral_statement/Yageo-company-3.pdf?src-supplier=Compliance+Statements; ComponentLink19URL: http://sigma.octopart.com:80/rohs_statement/Yageo-company-2.pdf?src-supplier=Compliance+Statements; ComponentLink19Description: http://sigma.octopart.com:80/rohs_statement/Yageo-company-2.pdf?src-supplier=Compliance+Statements
R8 = ESR03EZPJ102: RES SMD 1K OHM 5% 1/4W 0603; Manufacturer: Rohm Semiconductor; Power (Watts): 0.25W, 1/4W; Temperature Coefficient: ±200ppm/°C; Part Number: ESR03EZPJ102; Value: 1 kOhms; ComponentLink1Description: Datasheet; ComponentLink1URL: https://www.rohm.com/datasheet/ESR01MZPF/esr-e; ComponentLink2Description: DigiKey Link; ComponentLink2URL: https://www.digikey.com/en/products/detail/rohm-semiconductor/ESR03EZPJ102/1762721; Composition: Thick Film; Device Package: 0603 (1608 Metric); Features: Automotive AEC-Q200, Pulse Withstanding; Height - Seated (Max): 0.022" (0.55mm); LastUpdated: 9.02.2024 20:43:34; Lifecycle Status: Active; Minimum Order: 1; Number of Terminations: 2; Operating Temperature: -55°C ~ 155°C; Package / Case: 0603 (1608 Metric); Packaging: TapeAndReel; PartId: 5452; Part Status: Active; Price: 0.01; Ratings: AEC-Q200; Resistance: 1 kOhms; Series: ESR; Size / Dimension: 0.063" L x 0.031" W (1.60mm x 0.80mm); Supplier 1: DigiKey; Supplier Part Number 1: 511-ESR03EZPJ102CT-ND; Supplier Device Package: 0603; Tolerance: ±5%